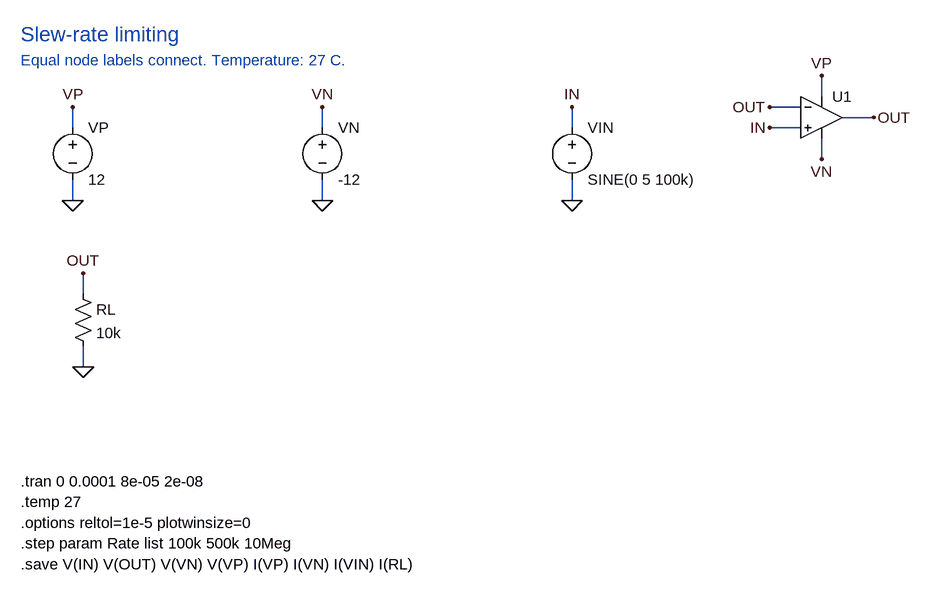
[diagram p0: schematic opamp-slew-rate.asc]
opamp-slew-rate.asc, the LTspice schematic file:
Version 4
SHEET 1 1740 1000
WIRE 144 176 144 144
WIRE 144 256 144 288
WIRE 528 176 528 144
WIRE 528 256 528 288
WIRE 912 176 912 144
WIRE 912 256 912 288
WIRE 1264 176 1216 176
WIRE 1264 144 1216 144
WIRE 1296 128 1296 96
WIRE 1296 192 1296 224
WIRE 1328 160 1376 160
WIRE 160 432 160 400
WIRE 160 512 160 544
FLAG 144 144 VP
FLAG 144 288 0
FLAG 528 144 VN
FLAG 528 288 0
FLAG 912 144 IN
FLAG 912 288 0
FLAG 1216 176 IN
FLAG 1216 144 OUT
FLAG 1296 96 VP
FLAG 1296 224 VN
FLAG 1376 160 OUT
FLAG 160 400 OUT
FLAG 160 544 0
SYMBOL voltage 144 160 R0
SYMATTR InstName VP
SYMATTR Value 12
SYMBOL voltage 528 160 R0
SYMATTR InstName VN
SYMATTR Value -12
SYMBOL voltage 912 160 R0
SYMATTR InstName VIN
SYMATTR Value SINE(0 5 100k)
SYMBOL OpAmps/UniversalOpamp2 1296 160 R0
SYMATTR InstName U1
SYMATTR SpiceModel level2
SYMATTR Value2 Avol=1Meg GBW=10Meg Slew={Rate}
SYMATTR SpiceLine Ilimit=100m Rail=0.5 Vos=0
SYMATTR SpiceLine2 En=0 Enk=0 In=0 Ink=0 Rin=1G
SYMBOL res 144 416 R0
SYMATTR InstName RL
SYMATTR Value 10k
TEXT 64 32 Left 3 ;Slew-rate limiting
TEXT 64 72 Left 2 ;Equal node labels connect. Temperature: 27 C.
TEXT 64 720 Left 2 !.tran 0 0.0001 8e-05 2e-08
TEXT 64 752 Left 2 !.temp 27
TEXT 64 784 Left 2 !.options reltol=1e-5 plotwinsize=0
TEXT 64 816 Left 2 !.step param Rate list 100k 500k 10Meg
TEXT 64 848 Left 2 !.save V(IN) V(OUT) V(VN) V(VP) I(VP) I(VN) I(VIN) I(RL)

The netlist it stands for:
* opamp-slew-rate.asc
VP VP 0 12
VN VN 0 -12
VIN IN 0 SINE(0 5 100k)
XU1 IN OUT VP VN OUT level2 Avol=1Meg GBW=10Meg Slew={Rate} Ilimit=100m Rail=0.5 Vos=0 En=0 Enk=0 In=0 Ink=0 Rin=1G  ; pins In+ In- V+ V- OUT
RL OUT 0 10k
* Slew-rate limiting
* Equal node labels connect. Temperature: 27 C.
.tran 0 0.0001 8e-05 2e-08
.temp 27
.options reltol=1e-5 plotwinsize=0
.step param Rate list 100k 500k 10Meg
.save V(IN) V(OUT) V(VN) V(VP) I(VP) I(VN) I(VIN) I(RL)
.lib UniversalOpAmp2.lib
.backanno
.end